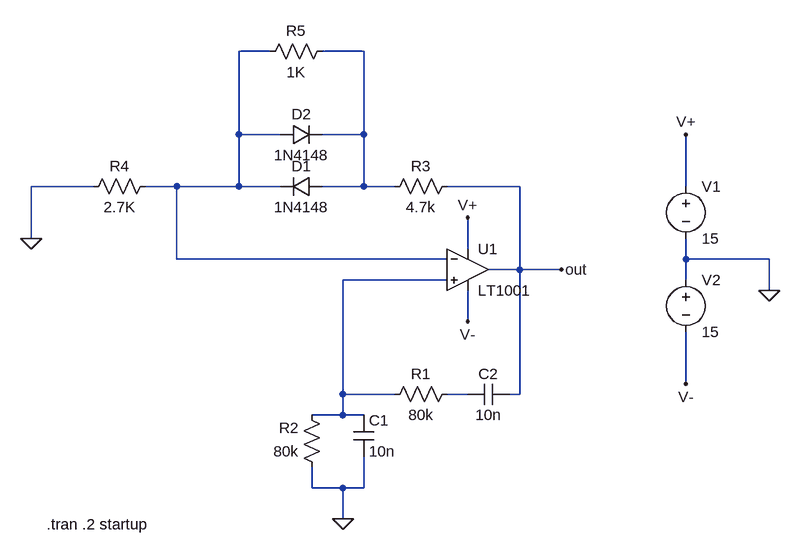
[diagram p0: schematic Wein Bridge Oscillator.asc]
Wein Bridge Oscillator.asc, the LTspice schematic file:
Version 4
SHEET 1 880 680
WIRE -64 -192 -112 -192
WIRE 80 -192 16 -192
WIRE -112 -64 -112 -192
WIRE -48 -64 -112 -64
WIRE 80 -64 80 -192
WIRE 80 -64 16 -64
WIRE -336 16 -432 16
WIRE -208 16 -256 16
WIRE -112 16 -112 -64
WIRE -112 16 -208 16
WIRE -48 16 -112 16
WIRE 80 16 80 -64
WIRE 80 16 16 16
WIRE 128 16 80 16
WIRE 320 16 208 16
WIRE 576 16 576 -64
WIRE -432 96 -432 16
WIRE 240 112 240 64
WIRE -208 128 -208 16
WIRE 208 128 -208 128
WIRE 576 128 576 96
WIRE 704 128 576 128
WIRE 320 144 320 16
WIRE 320 144 272 144
WIRE 384 144 320 144
WIRE 208 160 48 160
WIRE 576 160 576 128
WIRE 704 176 704 128
WIRE 240 224 240 176
WIRE 576 320 576 240
WIRE 48 336 48 160
WIRE 128 336 48 336
WIRE 240 336 208 336
WIRE 320 336 320 144
WIRE 320 336 304 336
WIRE 48 368 48 336
WIRE 48 368 0 368
WIRE 80 368 48 368
WIRE 0 480 0 448
WIRE 48 480 0 480
WIRE 80 480 80 432
WIRE 80 480 48 480
WIRE 48 528 48 480
FLAG 704 176 0
FLAG 48 528 0
FLAG 576 -64 V+
FLAG 240 64 V+
FLAG 576 320 V-
FLAG 240 224 V-
FLAG 384 144 out
FLAG -432 96 0
SYMBOL Opamps\\LT1001 240 80 R0
SYMATTR InstName U1
SYMBOL res 224 320 R90
WINDOW 0 0 56 VBottom 2
WINDOW 3 32 56 VTop 2
SYMATTR InstName R1
SYMATTR Value 80k
SYMBOL res 16 464 R180
WINDOW 0 36 76 Left 2
WINDOW 3 36 40 Left 2
SYMATTR InstName R2
SYMATTR Value 80k
SYMBOL cap 64 368 R0
SYMATTR InstName C1
SYMATTR Value 10n
SYMBOL cap 304 320 R90
WINDOW 0 0 32 VBottom 2
WINDOW 3 32 32 VTop 2
SYMATTR InstName C2
SYMATTR Value 10n
SYMBOL res 224 0 R90
WINDOW 0 0 56 VBottom 2
WINDOW 3 32 56 VTop 2
SYMATTR InstName R3
SYMATTR Value 4.7k
SYMBOL res -240 0 R90
WINDOW 0 0 56 VBottom 2
WINDOW 3 32 56 VTop 2
SYMATTR InstName R4
SYMATTR Value 2.7K
SYMBOL voltage 576 0 R0
WINDOW 123 0 0 Left 2
WINDOW 39 0 0 Left 2
SYMATTR InstName V1
SYMATTR Value 15
SYMBOL voltage 576 144 R0
WINDOW 123 0 0 Left 2
WINDOW 39 0 0 Left 2
SYMATTR InstName V2
SYMATTR Value 15
SYMBOL diode 16 0 R90
WINDOW 0 0 32 VBottom 2
WINDOW 3 32 32 VTop 2
SYMATTR InstName D1
SYMATTR Value 1N4148
SYMBOL diode -48 -48 R270
WINDOW 0 32 32 VTop 2
WINDOW 3 0 32 VBottom 2
SYMATTR InstName D2
SYMATTR Value 1N4148
SYMBOL res 32 -208 R90
WINDOW 0 0 56 VBottom 2
WINDOW 3 32 56 VTop 2
SYMATTR InstName R5
SYMATTR Value 1K
TEXT -408 536 Left 2 !.tran .2 startup

The netlist it stands for:
* Wein Bridge Oscillator.asc
XU1 N003 N001 V+ V- out LT1001  ; pins In+ In- V+ V- OUT
R1 N004 N003 80k
R2 0 N003 80k
C1 N003 0 10n
C2 out N004 10n
R3 out N002 4.7k
R4 N001 0 2.7K
V1 V+ 0 15
V2 0 V- 15
D1 N002 N001 1N4148
D2 N001 N002 1N4148
R5 N002 N001 1K
.model D D
.lib standard.dio
.tran .2 startup
.lib LTC.lib
.backanno
.end